# EAGLE design Charge Relay Board (EAGLE 6.5.1)
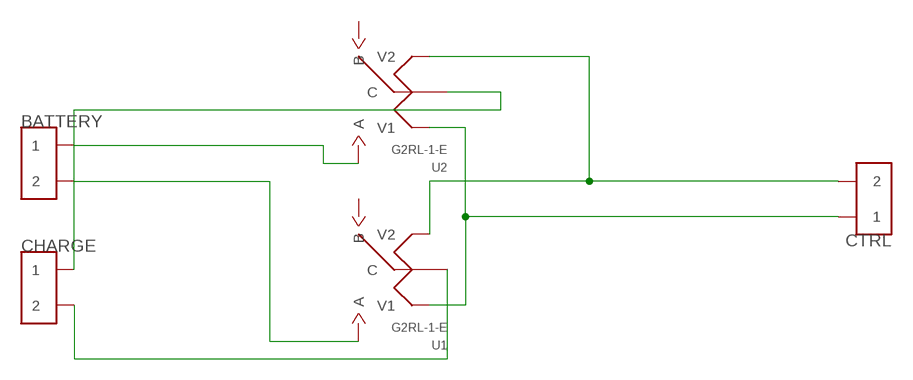
[diagram p0: schematic, sheet 1]

## Parts
BATTERY  CONN_2  [CONNECTOR_2]
CHARGE  CONN_2  [CONNECTOR_2]
CTRL  CONN_2  [CONNECTOR_2]
U1  G2RL-1-E  [G2RL-1-E_RELAY]
U2  G2RL-1-E  [G2RL-1-E_RELAY]

## Nets
N$1: CTRL.3 CTRL.4 U1.P$8(V2) U2.P$8(V2)
N$2: CTRL.1 CTRL.2 U1.P$1(V1) U2.P$1(V1)
N$3: BATTERY.1 BATTERY.2 U2.P$4(A) U2.P$5(A)
N$4: BATTERY.3 BATTERY.4 U1.P$4(A) U1.P$5(A)
N$5: CHARGE.1 CHARGE.2 U2.P$3(C) U2.P$6(C)
N$6: CHARGE.3 CHARGE.4 U1.P$3(C) U1.P$6(C)
Unconnected: U1.P$2(B) U1.P$7(B) U2.P$2(B) U2.P$7(B)

## Library data of the parts
BATTERY CHARGE CTRL = formula electric:CONN_2
U1 U2 = formula electric:G2RL-1-E: G2RL-1-E SPDT Relay, 16A, Digikey: Z2834-ND; COIL: DC 12

## Board
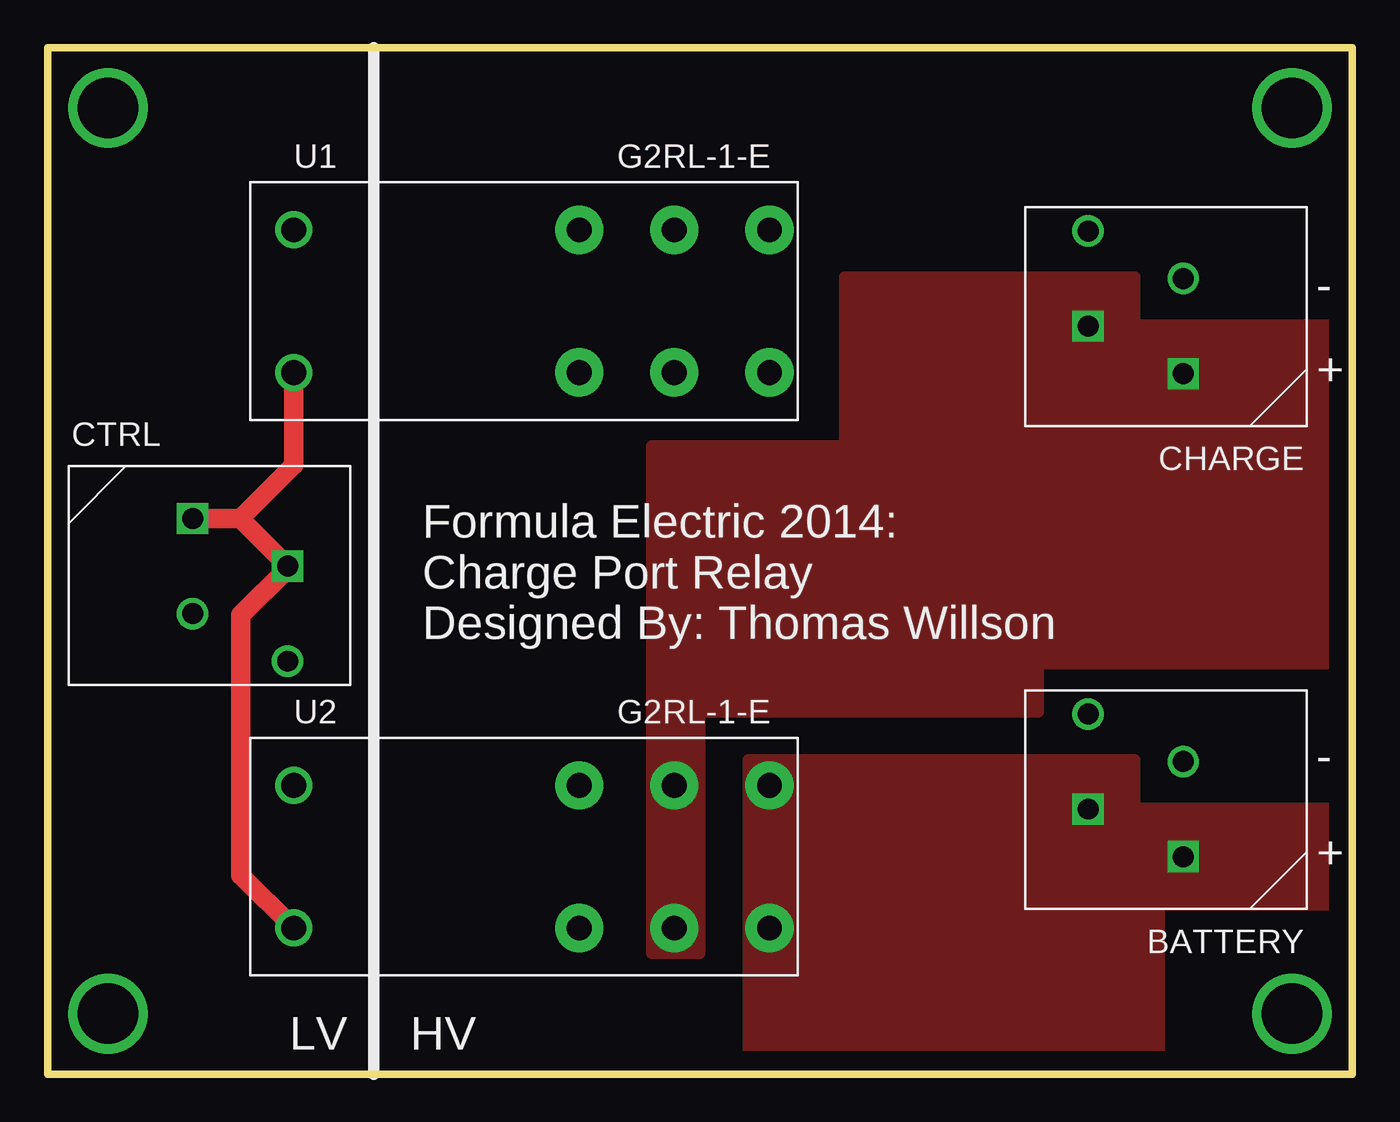
[diagram p1: board, top side]
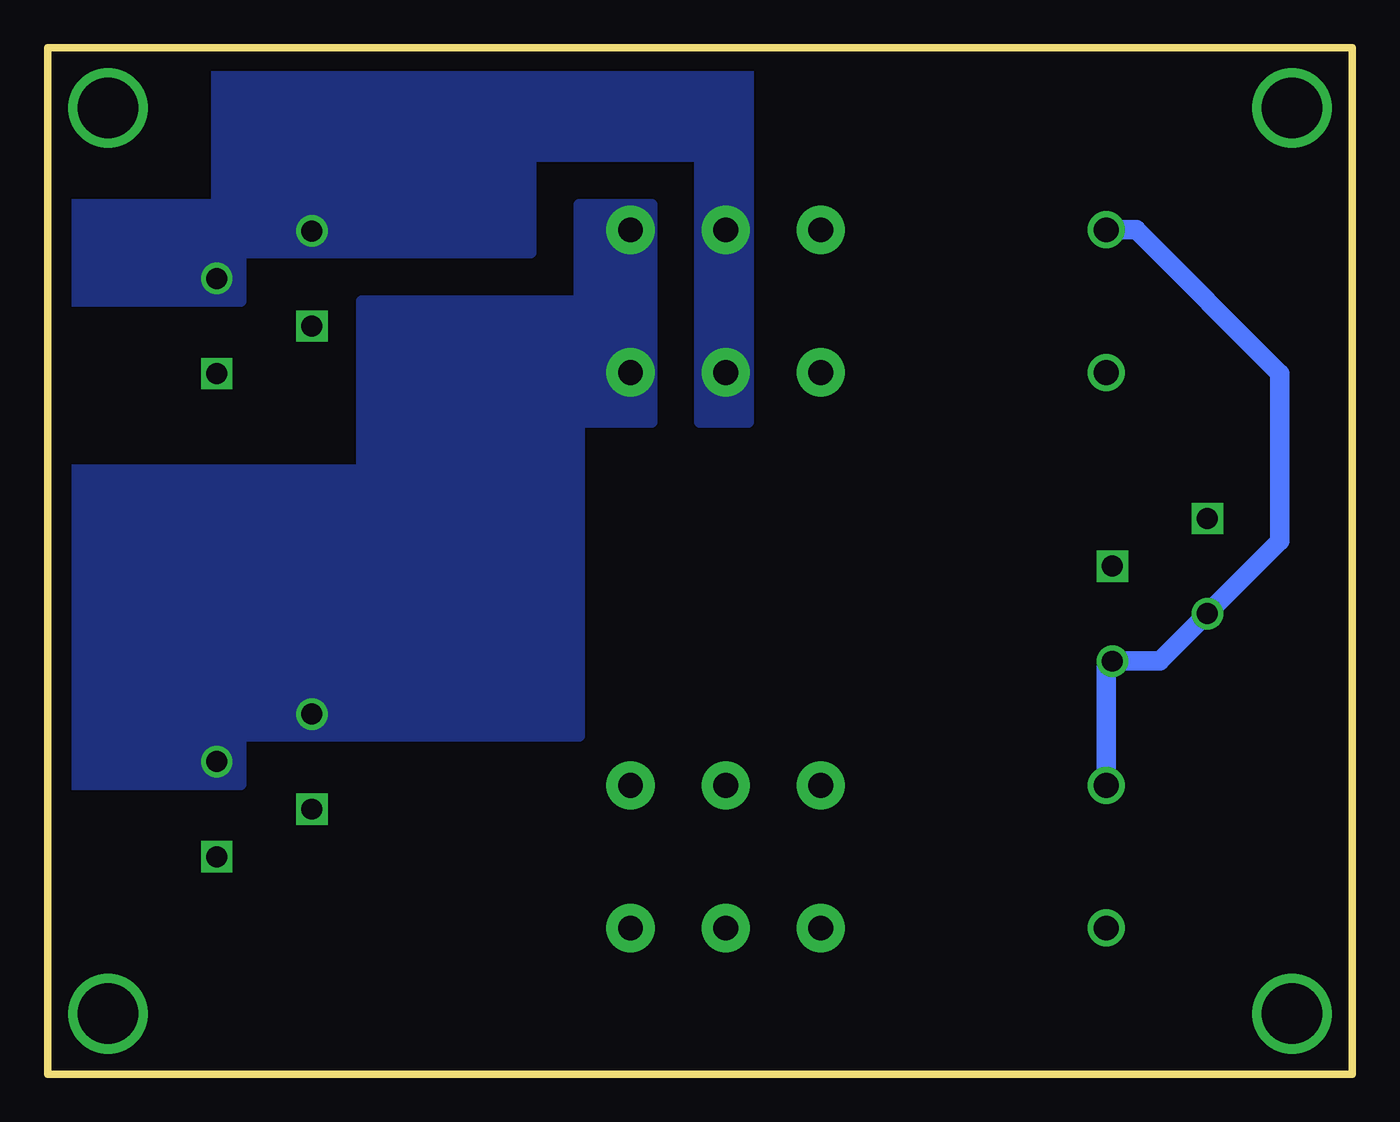
[diagram p2: board, bottom side, seen from below]

Size 68.58 x 53.98 mm. Coordinates in mm from the lower left corner, seen from the top.
Outline: 0,0 68.58,0 68.58,53.98 0,53.98 0,0
Copper layers (1*16): Top 0.035mm / dielectric 1.5mm / Bottom 0.035mm
Design rules "default": minimum track width 10mil, minimum drill 24mil, track to track 8mil, track to pad 8mil, pad to pad 8mil, via to via 8mil, smd to smd 8mil, copper to edge 40mil, drill to drill 8mil, minimum pad ring 10mil, minimum via ring 8mil, stop-mask expansion 4mil, vias tented up to drill 0mil, thermal gap 10mil

### Footprints (pad centres in the part's own frame; a part is rotated, then mirrored left to right if it is on the bottom)
CONNECTOR_2 = drill 1.1 square: 1 0,0; 2 2.5,5 | drill 1.1: 3 5,0; 4 7.5,5
G2RL-1-E_RELAY = drill 1.3: P$1 -15,-3.75; P$8 -15,3.75 | drill 1.3 pad 2.54: P$2 0,-3.75; P$3 5,-3.75; P$4 10,-3.75; P$5 10,3.75; P$6 5,3.75; P$7 0,3.75

### Placement (x,y rotation side)
BATTERY  59.69,11.43 90 top
CHARGE  59.69,36.83 90 top
CTRL  7.62,29.21 270 top
U1  27.94,40.64 0 top
U2  27.94,11.43 0 top

### Tracks (layer width: path | path; a pad name or v marks a point on that pad's centre or on a via)
N$1
  Bottom 1.016: U2.P$8 12.94,21.39 CTRL.4 10.12,21.71 CTRL.3 3.81,28.02 3.81,36.83 11.37,44.39 U1.P$8
N$2
  Top 1.016: U2.P$1 10.16,10.46 10.16,24.13 12.62,26.59 CTRL.2 10.12,29.21 | 10.12,29.21 CTRL.1 | 10.12,29.21 12.94,32.03 U1.P$1
N$3
  pour Top (no thermals): 36.83,16.51 36.83,1.27 58.42,1.27 58.42,8.89 67.31,8.89 67.31,13.97 57.15,13.97 57.15,16.51
N$4
  pour Bottom (no thermals): 67.31,31.75 67.31,15.24 58.42,15.24 58.42,17.78 40.64,17.78 40.64,34.29 36.83,34.29 36.83,45.72 40.64,45.72 40.64,40.64 52.07,40.64 52.07,31.75
N$5
  pour Top (no thermals): 67.31,39.37 57.15,39.37 57.15,41.91 41.91,41.91 41.91,33.02 31.75,33.02 31.75,6.35 34.29,6.35 34.29,19.05 52.07,19.05 52.07,21.59 67.31,21.59
N$6
  pour Bottom (no thermals): 67.31,45.72 67.31,40.64 58.42,40.64 58.42,43.18 43.18,43.18 43.18,48.26 34.29,48.26 34.29,34.29 31.75,34.29 31.75,54.61 59.69,54.61 59.69,45.72
N$7  (via drill 3.17)
  other vias: 3.17,50.8
N$8  (via drill 3.17)
  other vias: 3.17,3.17
N$9  (via drill 3.17)
  other vias: 65.41,50.8
N$10  (via drill 3.17)
  other vias: 65.41,3.17

### Text on the board
tPlace: LV | HV
tNames: - | + | Formula Electric 2014: / Charge Port Relay / Designed By: Thomas Willson | - | +